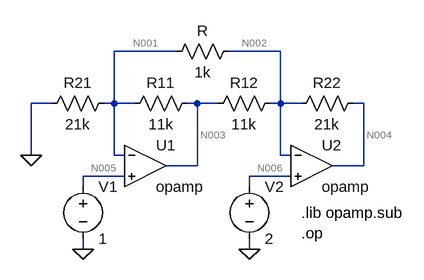
[diagram p0: schematic pag8es14.asc]
pag8es14.asc, the LTspice schematic file:
Version 4
SHEET 1 880 680
WIRE 192 16 96 16
WIRE 352 16 272 16
WIRE 0 96 -32 96
WIRE 96 96 96 16
WIRE 96 96 80 96
WIRE 128 96 96 96
WIRE 224 96 208 96
WIRE 256 96 224 96
WIRE 352 96 352 16
WIRE 352 96 336 96
WIRE 384 96 352 96
WIRE 480 96 464 96
WIRE -32 176 -32 96
WIRE 96 176 96 96
WIRE 112 176 96 176
WIRE 352 176 352 96
WIRE 368 176 352 176
WIRE 224 192 224 96
WIRE 224 192 176 192
WIRE 480 192 480 96
WIRE 480 192 432 192
WIRE 112 208 48 208
WIRE 368 208 304 208
WIRE 48 224 48 208
WIRE 304 224 304 208
WIRE 48 320 48 304
WIRE 304 320 304 304
FLAG -32 176 0
FLAG 48 320 0
FLAG 304 320 0
SYMBOL res 96 80 R90
WINDOW 0 0 56 VBottom 2
WINDOW 3 32 56 VTop 2
SYMATTR InstName R21
SYMATTR Value 21k
SYMBOL OpAmps\\opamp 144 128 R0
SYMATTR InstName U1
SYMBOL voltage 48 208 R0
SYMATTR InstName V1
SYMATTR Value 1
SYMBOL res 224 80 R90
WINDOW 0 0 56 VBottom 2
WINDOW 3 32 56 VTop 2
SYMATTR InstName R11
SYMATTR Value 11k
SYMBOL res 352 80 R90
WINDOW 0 0 56 VBottom 2
WINDOW 3 32 56 VTop 2
SYMATTR InstName R12
SYMATTR Value 11k
SYMBOL OpAmps\\opamp 400 128 R0
SYMATTR InstName U2
SYMBOL voltage 304 208 R0
SYMATTR InstName V2
SYMATTR Value 2
SYMBOL res 480 80 R90
WINDOW 0 0 56 VBottom 2
WINDOW 3 32 56 VTop 2
SYMATTR InstName R22
SYMATTR Value 21k
SYMBOL res 176 32 R270
WINDOW 0 32 56 VTop 2
WINDOW 3 0 56 VBottom 2
SYMATTR InstName R
SYMATTR Value 1k
TEXT 384 264 Left 2 !.lib opamp.sub
TEXT 384 296 Left 2 !.op

The netlist it stands for:
* pag8es14.asc
R21 N001 0 21k
XU1 N001 N005 N003 opamp Aol=100K GBW=10Meg  ; pins invin noninvin out
V1 N005 0 1
R11 N003 N001 11k
R12 N002 N003 11k
XU2 N002 N006 N004 opamp Aol=100K GBW=10Meg  ; pins invin noninvin out
V2 N006 0 2
R22 N004 N002 21k
R N001 N002 1k
.lib opamp.sub
.op
.backanno
.end

* Results of the author's LTspice run, read from the files saved beside the schematic
* Operating Point:
*   V(n001) = 1 V
*   V(n003) = -9.47 V
*   V(n005) = 1 V
*   V(n002) = 2 V
*   V(n004) = 44.88 V
*   V(n006) = 2 V
*   I(R) = -999.5 µA
*   I(R22) = 2.042 mA
*   I(R12) = 1.043 mA
*   I(R11) = -951.8 µA
*   I(R21) = 47.62 µA
*   I(V2) = 0 A
*   I(V1) = 0 A
*   Ix(u1:3) = 1.995 mA
*   Ix(u2:3) = -2.042 mA